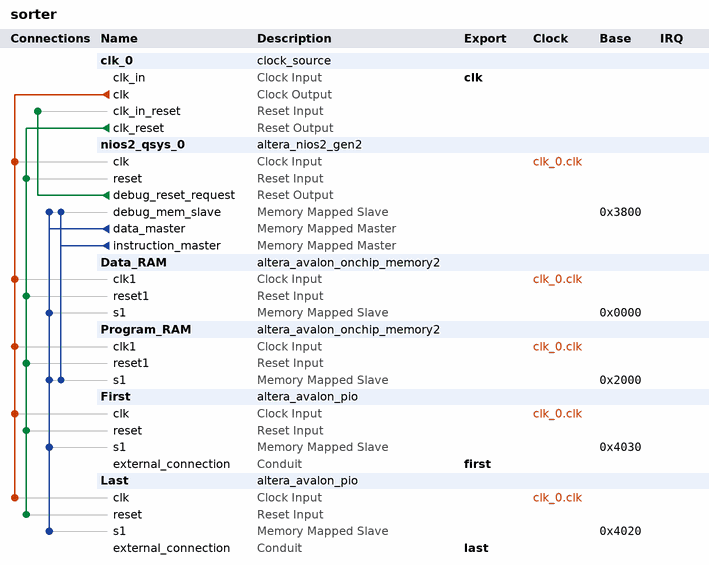
[diagram p0: system contents]
# Platform Designer (Qsys) system sorter, Cyclone V 5CEBA4F23C7
# Parameters at their usual value, and those the tool derives, are not listed.
package require -exact qsys 18.1
create_system sorter
set_project_property DEVICE_FAMILY {Cyclone V}
set_project_property DEVICE 5CEBA4F23C7

add_instance clk_0 clock_source 18.1
set_instance_parameter_value clk_0 clockFrequency 50000000

add_instance nios2_qsys_0 altera_nios2_gen2 18.1
set_instance_parameter_value nios2_qsys_0 dcache_size 2048
set_instance_parameter_value nios2_qsys_0 exceptionSlave Program_RAM.s1
set_instance_parameter_value nios2_qsys_0 icache_size 4096
set_instance_parameter_value nios2_qsys_0 impl Tiny
set_instance_parameter_value nios2_qsys_0 resetSlave Program_RAM.s1
set_instance_parameter_value nios2_qsys_0 setting_activateTrace true

add_instance Data_RAM altera_avalon_onchip_memory2 18.1
set_instance_parameter_value Data_RAM dataWidth 8
set_instance_parameter_value Data_RAM dualPort false
set_instance_parameter_value Data_RAM initMemContent true
set_instance_parameter_value Data_RAM initializationFileName Datamem.hex
set_instance_parameter_value Data_RAM memorySize 4096
set_instance_parameter_value Data_RAM useNonDefaultInitFile true

add_instance Program_RAM altera_avalon_onchip_memory2 18.1
set_instance_parameter_value Program_RAM dataWidth 32
set_instance_parameter_value Program_RAM dualPort false
set_instance_parameter_value Program_RAM initMemContent true
set_instance_parameter_value Program_RAM initializationFileName onchip_mem.hex
set_instance_parameter_value Program_RAM memorySize 4096

add_instance First altera_avalon_pio 18.1
set_instance_parameter_value First direction Output
set_instance_parameter_value First width 8

add_instance Last altera_avalon_pio 18.1
set_instance_parameter_value Last direction Output
set_instance_parameter_value Last width 8

# connections
add_connection clk_0.clk Data_RAM.clk1 clock
add_connection clk_0.clk First.clk clock
add_connection clk_0.clk Last.clk clock
add_connection clk_0.clk nios2_qsys_0.clk clock
add_connection clk_0.clk Program_RAM.clk1 clock
add_connection clk_0.clk_reset Data_RAM.reset1 reset
add_connection clk_0.clk_reset First.reset reset
add_connection clk_0.clk_reset Last.reset reset
add_connection clk_0.clk_reset nios2_qsys_0.reset reset
add_connection clk_0.clk_reset Program_RAM.reset1 reset
add_connection nios2_qsys_0.debug_reset_request clk_0.clk_in_reset reset
add_connection nios2_qsys_0.data_master Data_RAM.s1 avalon
set_connection_parameter_value nios2_qsys_0.data_master/Data_RAM.s1 baseAddress 0x0000
add_connection nios2_qsys_0.data_master First.s1 avalon
set_connection_parameter_value nios2_qsys_0.data_master/First.s1 baseAddress 0x4030
add_connection nios2_qsys_0.data_master Last.s1 avalon
set_connection_parameter_value nios2_qsys_0.data_master/Last.s1 baseAddress 0x4020
add_connection nios2_qsys_0.data_master nios2_qsys_0.debug_mem_slave avalon
set_connection_parameter_value nios2_qsys_0.data_master/nios2_qsys_0.debug_mem_slave baseAddress 0x3800
add_connection nios2_qsys_0.data_master Program_RAM.s1 avalon
set_connection_parameter_value nios2_qsys_0.data_master/Program_RAM.s1 baseAddress 0x2000
add_connection nios2_qsys_0.instruction_master nios2_qsys_0.debug_mem_slave avalon
set_connection_parameter_value nios2_qsys_0.instruction_master/nios2_qsys_0.debug_mem_slave baseAddress 0x3800
add_connection nios2_qsys_0.instruction_master Program_RAM.s1 avalon
set_connection_parameter_value nios2_qsys_0.instruction_master/Program_RAM.s1 baseAddress 0x2000

# exported interfaces
add_interface clk clock sink
set_interface_property clk EXPORT_OF clk_0.clk_in
add_interface first conduit end
set_interface_property first EXPORT_OF First.external_connection
add_interface last conduit end
set_interface_property last EXPORT_OF Last.external_connection

set_interconnect_requirement {$system} qsys_mm.clockCrossingAdapter HANDSHAKE
set_interconnect_requirement {$system} qsys_mm.enableEccProtection FALSE
set_interconnect_requirement {$system} qsys_mm.insertDefaultSlave FALSE
set_interconnect_requirement {$system} qsys_mm.maxAdditionalLatency 1

save_system sorter.qsys
